# Altium project Siwa_Project.PrjPcb
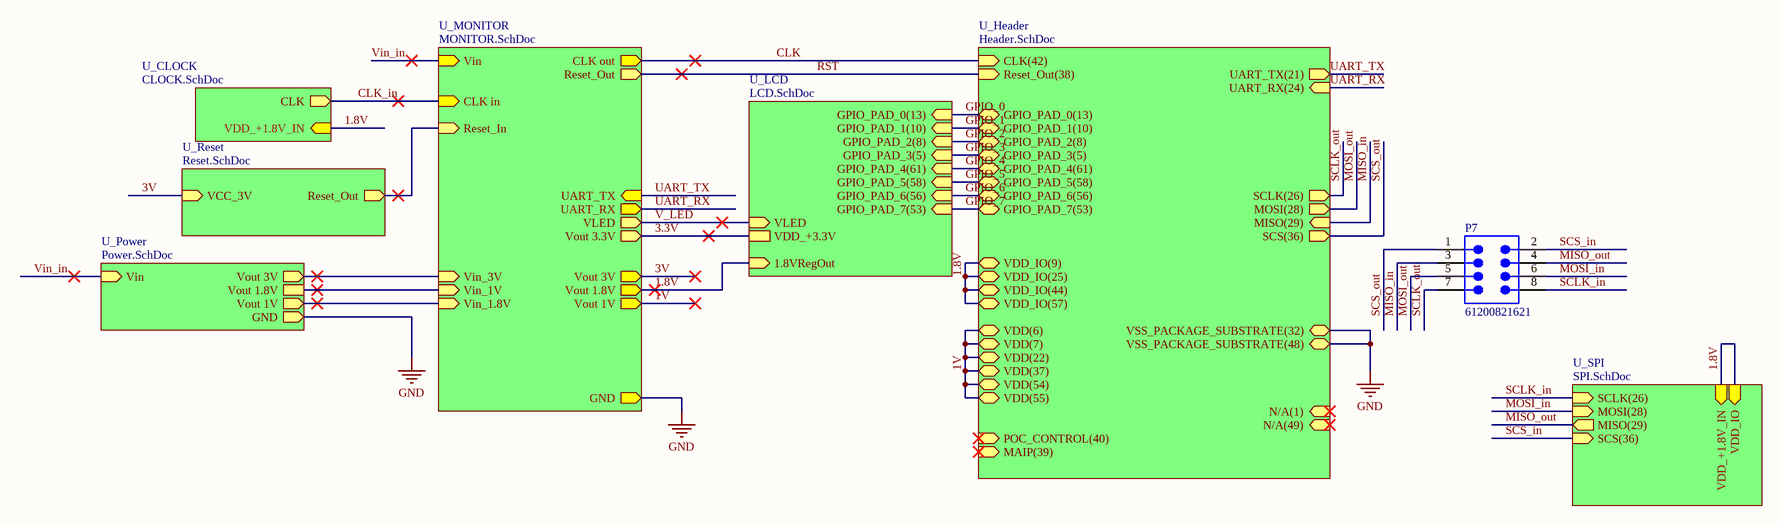
[diagram p0: TOP_SCHEMATIC (1).SchDoc]
9 sheets, 135 parts. Net scope: hierarchical (ports join the sheet entries above them; power ports are global).
Board files: SIWA_PCB.PcbDoc, PCB1.PcbDoc, PCB2.PcbDoc, PCB3.PcbDoc
Sheets:
  TOP_SCHEMATIC (1).SchDoc
    U_Header = Header.SchDoc
    U_CLOCK = CLOCK.SchDoc
    U_SPI = SPI.SchDoc
    U_MONITOR = MONITOR.SchDoc
    U_Power = Power.SchDoc
    U_Reset = Reset.SchDoc
    U_LCD = LCD.SchDoc
  TOP_SCHEMATIC.SchDoc
    U_Header = Header.SchDoc
    U_CLOCK = CLOCK.SchDoc
    U_SPI = SPI.SchDoc
    U_MONITOR = MONITOR.SchDoc
    U_Power = Power.SchDoc
    U_Reset = Reset.SchDoc
    U_LCD = LCD.SchDoc

## Sheet TOP_SCHEMATIC (1).SchDoc
size A3; SheetNumber: 1; SheetTotal: 8

### Parts
P7  61200821621  [61200821621]

### Sub-sheets
U_CLOCK = CLOCK.SchDoc: VDD_+1.8V_IN (in), CLK (out)
U_Header = Header.SchDoc: UART_TX(21) (out), UART_RX(24) (in), VDD(6) (bidir), CLK(42) (in), VDD_IO(44) (bidir), VDD_IO(25) (bidir), VDD_IO(9) (bidir), VDD(7) (bidir), VDD(22) (bidir), Reset_Out(38) (in), VDD(55) (bidir), VDD(54) (bidir), VDD(37) (bidir), SCLK(26) (out), MOSI(28) (out), MISO(29) (in), SCS(36) (out), VSS_PACKAGE_SUBSTRATE(32) (bidir), VSS_PACKAGE_SUBSTRATE(48) (bidir), N/A(1) (in), N/A(49) (in), POC_CONTROL(40) (in), MAIP(39) (in), GPIO_PAD_0(13) (bidir), GPIO_PAD_1(10) (bidir), GPIO_PAD_2(8) (bidir), GPIO_PAD_3(5) (bidir), GPIO_PAD_4(61) (bidir), GPIO_PAD_5(58) (bidir), GPIO_PAD_6(56) (bidir), GPIO_PAD_7(53) (bidir), VDD_IO(57) (bidir)
U_LCD = LCD.SchDoc: GPIO_PAD_0(13) (in), GPIO_PAD_7(53) (in), GPIO_PAD_6(56) (in), GPIO_PAD_5(58) (in), GPIO_PAD_4(61) (in), GPIO_PAD_1(10) (in), GPIO_PAD_2(8) (in), GPIO_PAD_3(5) (in), 1.8VRegOut (in), VDD_+3.3V, VLED (in)
U_MONITOR = MONITOR.SchDoc: Vin (in), CLK in (in), Reset_In (in), GND (out), CLK out (out), Reset_Out (out), UART_TX (in), UART_RX (out), Vout 3V (out), Vout 1.8V (out), Vout 1V (out), Vin_3V (in), Vin_1V (in), Vin_1.8V (in), Vout 3.3V (out), VLED (out)
U_Power = Power.SchDoc: Vin (in), Vout 3V (out), Vout 1.8V, GND (out), Vout 1V (out)
U_Reset = Reset.SchDoc: VCC_3V (in), Reset_Out (out)
U_SPI = SPI.SchDoc: MOSI(28) (in), SCLK(26) (in), MISO(29) (out), SCS(36) (in), VDD_IO (in), VDD_+1.8V_IN (in)

### Nets
GND: sheet U_Header/VSS_PACKAGE_SUBSTRATE(32), sheet U_Header/VSS_PACKAGE_SUBSTRATE(48), sheet U_MONITOR/GND, sheet U_Power/GND
1.8V: sheet U_Header/VDD_IO(44), sheet U_Header/VDD_IO(25), sheet U_Header/VDD_IO(9), sheet U_Header/VDD_IO(57), sheet U_CLOCK/VDD_+1.8V_IN, sheet U_SPI/VDD_IO, sheet U_SPI/VDD_+1.8V_IN, sheet U_MONITOR/Vout 1.8V, sheet U_LCD/1.8VRegOut
1V: sheet U_Header/VDD(6), sheet U_Header/VDD(7), sheet U_Header/VDD(22), sheet U_Header/VDD(55), sheet U_Header/VDD(54), sheet U_Header/VDD(37), sheet U_MONITOR/Vout 1V
3.3V: sheet U_MONITOR/Vout 3.3V, sheet U_LCD/VDD_+3.3V
3V: sheet U_MONITOR/Vout 3V, sheet U_Reset/VCC_3V
CLK: sheet U_Header/CLK(42), sheet U_MONITOR/CLK out
CLK_in: sheet U_CLOCK/CLK, sheet U_MONITOR/CLK in
GPIO_0: sheet U_Header/GPIO_PAD_0(13), sheet U_LCD/GPIO_PAD_0(13)
GPIO_1: sheet U_Header/GPIO_PAD_1(10), sheet U_LCD/GPIO_PAD_1(10)
GPIO_2: sheet U_Header/GPIO_PAD_2(8), sheet U_LCD/GPIO_PAD_2(8)
GPIO_3: sheet U_Header/GPIO_PAD_3(5), sheet U_LCD/GPIO_PAD_3(5)
GPIO_4: sheet U_Header/GPIO_PAD_4(61), sheet U_LCD/GPIO_PAD_4(61)
GPIO_5: sheet U_Header/GPIO_PAD_5(58), sheet U_LCD/GPIO_PAD_5(58)
GPIO_6: sheet U_Header/GPIO_PAD_6(56), sheet U_LCD/GPIO_PAD_6(56)
GPIO_7: sheet U_Header/GPIO_PAD_7(53), sheet U_LCD/GPIO_PAD_7(53)
MISO_in: P7.3 ; sheet U_Header/MISO(29)
MISO_out: P7.4 ; sheet U_SPI/MISO(29)
MOSI_in: P7.6 ; sheet U_SPI/MOSI(28)
MOSI_out: P7.5 ; sheet U_Header/MOSI(28)
RST: sheet U_Header/Reset_Out(38), sheet U_MONITOR/Reset_Out
RST_IN: sheet U_MONITOR/Reset_In, sheet U_Reset/Reset_Out
SCLK_in: P7.8 ; sheet U_SPI/SCLK(26)
SCLK_out: P7.7 ; sheet U_Header/SCLK(26)
SCS_in: P7.2 ; sheet U_SPI/SCS(36)
SCS_out: P7.1 ; sheet U_Header/SCS(36)
UART_RX: sheet U_Header/UART_RX(24), sheet U_MONITOR/UART_RX
UART_TX: sheet U_Header/UART_TX(21), sheet U_MONITOR/UART_TX
V_LED: sheet U_MONITOR/VLED, sheet U_LCD/VLED
Vin_in: sheet U_MONITOR/Vin, sheet U_Power/Vin
Vout 1.8V: sheet U_MONITOR/Vin_1V, sheet U_Power/Vout 1.8V
Vout_1V: sheet U_MONITOR/Vin_1.8V, sheet U_Power/Vout 1V
Vout_3V: sheet U_MONITOR/Vin_3V, sheet U_Power/Vout 3V

### Library data of the parts
P7 = CMP-1502-00006-3: Wr-bhd; 2.54MM Pitch 8 Way 2 Row Shrouded Straight Pcb Header, Surface Mount; Number of Contacts: 8; Operating Supply Voltage: 250V; Gender: Male; Current Rating: 3A; Contact Resistance: 20mΩ; Connector Type: Male Pin; Insulation Resistance: 1GΩ; Pitch: 2.54mm; RoHS: Compliant; Row Spacing: 2.54mm; Color: Black; Termination: Solder; Min Operating Temperature: -40°C; Number of Rows: 2; Number of Positions: 8; Contact Material: Copper; Orientation: Vertical; Number of Pins: 8; Contact Plating: Gold; Insulation Material: PBT; Lead Pitch: 2.54mm; Length: 17.82mm; Max Operating Temperature: 105°C; Mount: Through Hole

## Sheet Header.SchDoc
size A4; SheetNumber: 4; SheetTotal: 8
Used 2 times, as channels U_Header, U_Header. Parts and nets are listed once, with the designators drawn on the sheet.
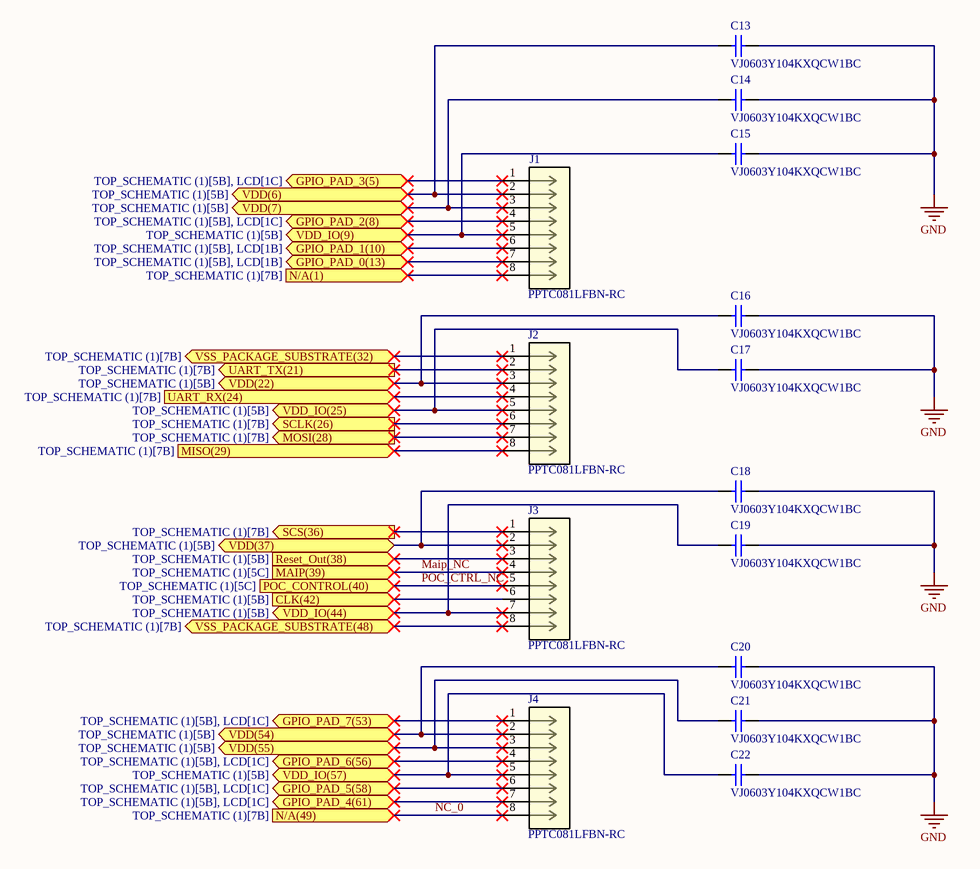
[diagram p1: Header.SchDoc]

### Parts
C13  VJ0603Y104KXQCW1BC  [CAPC1608X95X40NL15T15]
C14  VJ0603Y104KXQCW1BC  [CAPC1608X95X40NL15T15]
C15  VJ0603Y104KXQCW1BC  [CAPC1608X95X40NL15T15]
C16  VJ0603Y104KXQCW1BC  [CAPC1608X95X40NL15T15]
C17  VJ0603Y104KXQCW1BC  [CAPC1608X95X40NL15T15]
C18  VJ0603Y104KXQCW1BC  [CAPC1608X95X40NL15T15]
C19  VJ0603Y104KXQCW1BC  [CAPC1608X95X40NL15T15]
C20  VJ0603Y104KXQCW1BC  [CAPC1608X95X40NL15T15]
C21  VJ0603Y104KXQCW1BC  [CAPC1608X95X40NL15T15]
C22  VJ0603Y104KXQCW1BC  [CAPC1608X95X40NL15T15]
J1  PPTC081LFBN-RC  [CONN_PPTC081LFBN-RC_SUL]
J2  PPTC081LFBN-RC  [CONN_PPTC081LFBN-RC_SUL]
J3  PPTC081LFBN-RC  [CONN_PPTC081LFBN-RC_SUL]
J4  PPTC081LFBN-RC  [CONN_PPTC081LFBN-RC_SUL]

### Ports
CLK(42) (in, see TOP_SCHEMATIC (1)[5B]), GPIO_PAD_0(13) (bidir, see TOP_SCHEMATIC (1)[5B], LCD[1B]), GPIO_PAD_1(10) (bidir, see TOP_SCHEMATIC (1)[5B], LCD[1B]), GPIO_PAD_2(8) (bidir, see TOP_SCHEMATIC (1)[5B], LCD[1C]), GPIO_PAD_3(5) (bidir, see TOP_SCHEMATIC (1)[5B], LCD[1C]), GPIO_PAD_4(61) (bidir, see TOP_SCHEMATIC (1)[5B], LCD[1C]), GPIO_PAD_5(58) (bidir, see TOP_SCHEMATIC (1)[5B], LCD[1C]), GPIO_PAD_6(56) (bidir, see TOP_SCHEMATIC (1)[5B], LCD[1C]), GPIO_PAD_7(53) (bidir, see TOP_SCHEMATIC (1)[5B], LCD[1C]), MAIP(39) (in, see TOP_SCHEMATIC (1)[5C]), MISO(29) (in, see TOP_SCHEMATIC (1)[7B]), MOSI(28) (out, see TOP_SCHEMATIC (1)[7B]), N/A(1) (in, see TOP_SCHEMATIC (1)[7B]), N/A(49) (in, see TOP_SCHEMATIC (1)[7B]), POC_CONTROL(40) (in, see TOP_SCHEMATIC (1)[5C]), Reset_Out(38) (in, see TOP_SCHEMATIC (1)[5B]), SCLK(26) (out, see TOP_SCHEMATIC (1)[7B]), SCS(36) (out, see TOP_SCHEMATIC (1)[7B]), UART_RX(24) (in, see TOP_SCHEMATIC (1)[7B]), UART_TX(21) (out, see TOP_SCHEMATIC (1)[7B]), VDD(6) (bidir, see TOP_SCHEMATIC (1)[5B]), VDD(7) (bidir, see TOP_SCHEMATIC (1)[5B]), VDD(22) (bidir, see TOP_SCHEMATIC (1)[5B]), VDD(37) (bidir, see TOP_SCHEMATIC (1)[5B]), VDD(54) (bidir, see TOP_SCHEMATIC (1)[5B]), VDD(55) (bidir, see TOP_SCHEMATIC (1)[5B]), VDD_IO(9) (bidir, see TOP_SCHEMATIC (1)[5B]), VDD_IO(25) (bidir, see TOP_SCHEMATIC (1)[5B]), VDD_IO(44) (bidir, see TOP_SCHEMATIC (1)[5B]), VDD_IO(57) (bidir, see TOP_SCHEMATIC (1)[5B]), VSS_PACKAGE_SUBSTRATE(32) (bidir, see TOP_SCHEMATIC (1)[7B]), VSS_PACKAGE_SUBSTRATE(48) (bidir, see TOP_SCHEMATIC (1)[7B])

### Nets
GND: C13.2 C14.2 C15.2 C16.2 C17.2 C18.2 C19.2 C20.2 C21.2 C22.2
CLK(42): J3.6 ; port CLK(42)
GPIO_PAD_0(13): J1.7 ; port GPIO_PAD_0(13)
GPIO_PAD_1(10): J1.6 ; port GPIO_PAD_1(10)
GPIO_PAD_2(8): J1.4 ; port GPIO_PAD_2(8)
GPIO_PAD_3(5): J1.1 ; port GPIO_PAD_3(5)
GPIO_PAD_4(61): J4.7 ; port GPIO_PAD_4(61)
GPIO_PAD_5(58): J4.6 ; port GPIO_PAD_5(58)
GPIO_PAD_6(56): J4.4 ; port GPIO_PAD_6(56)
GPIO_PAD_7(53): J4.1 ; port GPIO_PAD_7(53)
Maip_NC: J3.4 ; port MAIP(39)
MISO(29): J2.8 ; port MISO(29)
MOSI(28): J2.7 ; port MOSI(28)
N/A(1): J1.8 ; port N/A(1)
NC_0: J4.8 ; port N/A(49)
POC_CTRL_NC: J3.5 ; port POC_CONTROL(40)
Reset_Out(38): J3.3 ; port Reset_Out(38)
SCLK(26): J2.6 ; port SCLK(26)
SCS(36): J3.1 ; port SCS(36)
UART_RX(24): J2.4 ; port UART_RX(24)
UART_TX(21): J2.2 ; port UART_TX(21)
VDD(6): C13.1 J1.2 ; port VDD(6)
VDD(7): C14.1 J1.3 ; port VDD(7)
VDD(22): C16.1 J2.3 ; port VDD(22)
VDD(37): C18.1 J3.2 ; port VDD(37)
VDD(54): C20.1 J4.2 ; port VDD(54)
VDD(55): C21.1 J4.3 ; port VDD(55)
VDD_IO(9): C15.1 J1.5 ; port VDD_IO(9)
VDD_IO(25): C17.1 J2.5 ; port VDD_IO(25)
VDD_IO(44): C19.1 J3.7 ; port VDD_IO(44)
VDD_IO(57): C22.1 J4.5 ; port VDD_IO(57)
VSS_PACKAGE_SUBSTRATE(32): J2.1 ; port VSS_PACKAGE_SUBSTRATE(32)
VSS_PACKAGE_SUBSTRATE(48): J3.8 ; port VSS_PACKAGE_SUBSTRATE(48)

### Channels
U_Header: ports CLK(42)=CLK GPIO_PAD_0(13)=GPIO_0 GPIO_PAD_1(10)=GPIO_1 GPIO_PAD_2(8)=GPIO_2 GPIO_PAD_3(5)=GPIO_3 GPIO_PAD_4(61)=GPIO_4 GPIO_PAD_5(58)=GPIO_5 GPIO_PAD_6(56)=GPIO_6 GPIO_PAD_7(53)=GPIO_7 MAIP(39)=Maip_NC_U_Header MISO(29)=MISO_in MOSI(28)=MOSI_out N/A(1)=NetJ1_8 N/A(49)=NC_0_U_Header POC_CONTROL(40)=POC_CTRL_NC_U_Header Reset_Out(38)=RST SCLK(26)=SCLK_out SCS(36)=SCS_out UART_RX(24)=UART_RX UART_TX(21)=UART_TX VDD(6)=1V VDD(7)=1V VDD(22)=1V VDD(37)=1V VDD(54)=1V VDD(55)=1V VDD_IO(9)=1.8V VDD_IO(25)=1.8V VDD_IO(44)=1.8V VDD_IO(57)=1.8V VSS_PACKAGE_SUBSTRATE(32)=GND VSS_PACKAGE_SUBSTRATE(48)=GND
U_Header: designators end in _U_Header; ports CLK(42)=NetJ3_U_Header_6 GPIO_PAD_0(13)=NetJ1_U_Header_7 GPIO_PAD_1(10)=NetJ1_U_Header_6 GPIO_PAD_2(8)=NetJ1_U_Header_4 GPIO_PAD_3(5)=NetJ1_U_Header_1 GPIO_PAD_4(61)=NetJ4_U_Header_7 GPIO_PAD_5(58)=NetJ4_U_Header_6 GPIO_PAD_6(56)=NetJ4_U_Header_4 GPIO_PAD_7(53)=NetJ4_U_Header_1 MAIP(39)=Maip_NC_U_Header MISO(29)=MISO MOSI(28)=MOSI N/A(1)=NetJ1_U_Header_8 N/A(49)=NC_0_U_Header POC_CONTROL(40)=POC_CTRL_NC_U_Header Reset_Out(38)=NetJ3_U_Header_3 SCLK(26)=SCLK SCS(36)=SCS UART_RX(24)=UART_RX UART_TX(21)=UART_TX VDD(6)=1.8V VDD(7)=1.8V VDD(22)=1.8V VDD(37)=1.8V VDD(54)=1.8V VDD(55)=1.8V VDD_IO(9)=1.8V VDD_IO(25)=1.8V VDD_IO(44)=1.8V VDD_IO(57)=1.8V VSS_PACKAGE_SUBSTRATE(32)=GND VSS_PACKAGE_SUBSTRATE(48)=GND

### Library data of the parts
C13-C22 = CMP-2006-01550-1: Manufacturer: Vitramon; Part Number: VJ0603Y104KXQCW1BC
J1-J4 = PPTC081LFBN-RC: Description; Manufacturer_Name: Sullins; Copyright: Copyright (C) 2026 Ultra Librarian. All rights reserved.; Manufacturer_Part_Number: PPTC081LFBN-RC; RefDes: RefDes; Type: Type

## Sheet CLOCK.SchDoc
size A4; SheetNumber: 2; SheetTotal: 8
Used 2 times, as channels U_CLOCK, U_CLOCK. Parts and nets are listed once, with the designators drawn on the sheet.
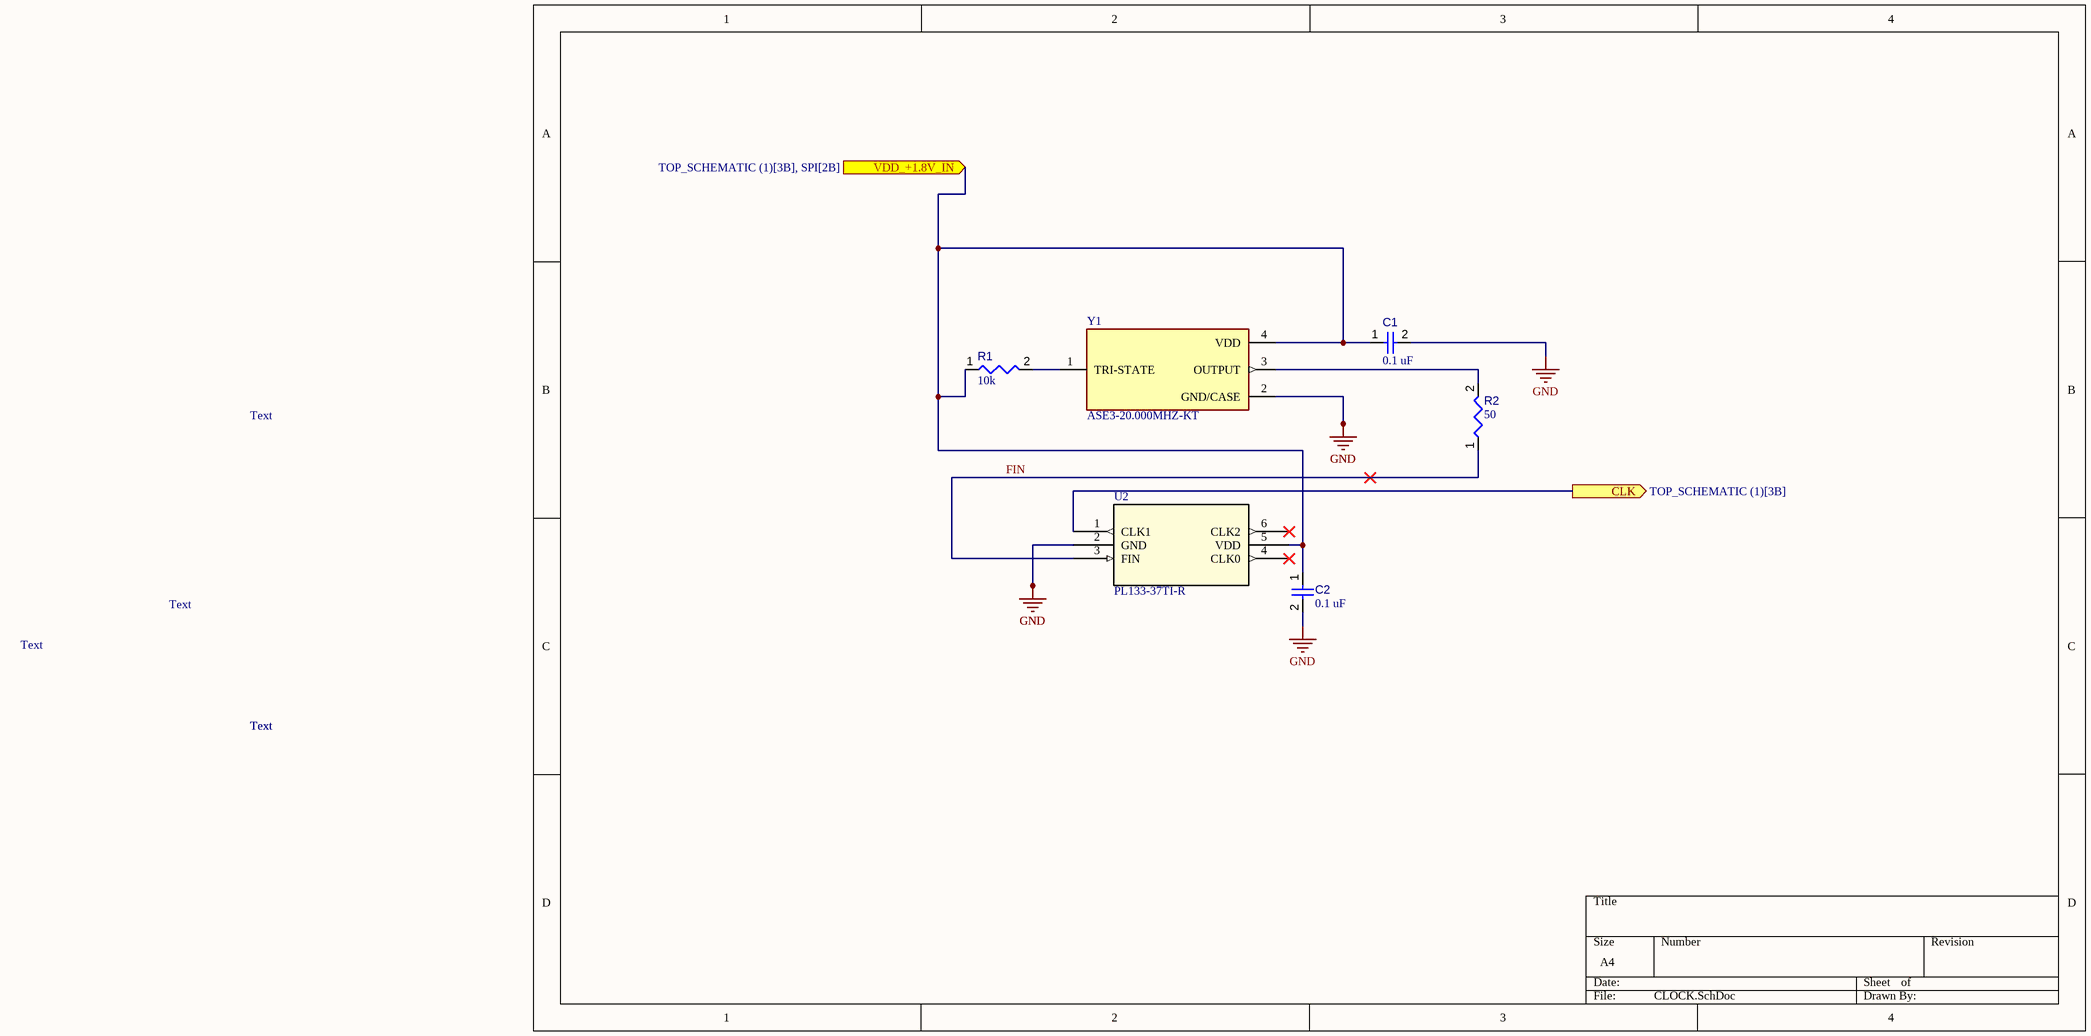
[diagram p2: CLOCK.SchDoc]

### Parts
C1  value 0.1 uF  [CAPC1608X90X40ML10T20]  (hidden comment: Capacitor 0.1 uF)
C2  value 0.1 uF  [CAPC1608X90X40ML10T20]  (hidden comment: Capacitor 0.1 uF)
R1  value 10k  [RESC2013X50X35ML15T15]  (hidden comment: Resistor 10k +/-1% 0805 125 mW)
R2  value 50  [RESC1608X55X25ML10T15]  (hidden comment: Resistor 50 +/-1% 0603 100 mW)
U2  PL133-37TI-R  [SOT-23-6_MC_MCH]
Y1  ASE3-20.000MHZ-KT  [XTAL_ASE3-20.000MHZ-KT]

### Ports
CLK (out, see TOP_SCHEMATIC (1)[3B]), VDD_+1.8V_IN (in, see TOP_SCHEMATIC (1)[3B], SPI[2B])

### Nets
GND: C1.2 C2.2 U2.2(GND) Y1.2(GND/CASE)
CLK: U2.1(CLK1) ; port CLK
FIN: R2.1 U2.3(FIN)
VDD_+1.8V_IN: C1.1 C2.1 R1.1 U2.5(VDD) Y1.4(VDD) ; port VDD_+1.8V_IN
NetR1_2: R1.2 Y1.1(TRI-STATE)
NetR2_2: R2.2 Y1.3(OUTPUT)

Not connected (* = marked no-connect by the designer): U2 4(CLK0)* 6(CLK2)*

### Channels
U_CLOCK: ports CLK=CLK_in VDD_+1.8V_IN=1.8V
U_CLOCK: designators end in _U_CLOCK; ports CLK=NetP6_U_MONITOR_7 VDD_+1.8V_IN=1.8V

### Notes on the sheet
- Text

### Library data of the parts
C1 C2 = CMP-001-00014-6: Chip Capacitor, 0.1 uF 0603; Capacitor Type: Ceramic; Tolerance: 5%; Voltage Rating: 50V; RoHS Compliant: True; Case/Package: 0603; Max Operating Temperature: 125°C; Pins: 2; Mounting Technology: SM; Min Operating Temperature: -55°C
R1 = CMP-009-00018-5: Chip Resistor, 10 KOhm, +/- 1%, 125 mW, -55 to 155 degC, 0805 (2012 Metric); Power: 125mW; Voltage Rating: 150V; Tolerance: 1%; Pins: 2; Min Operating Temperature: -55°C; Case/Package: 0805; Max Operating Temperature: 155°C; RoHS Compliant: True; Mounting Technology: SM
R2 = CMP-009-00017-5: Chip Resistor, 50 Ohm 0603; Voltage Rating: 50V; Power: 100mW; Tolerance: 1%; RoHS Compliant: True; Min Operating Temperature: -55°C; Pins: 2; Case/Package: 0603; Mounting Technology: SM; Max Operating Temperature: 155°C
U2 = PL133-37TI-R: Description; Manufacturer_Name: Microchip; Copyright: Copyright (C) 2025 Ultra Librarian. All rights reserved.; Manufacturer_Part_Number: PL133-37TI-R; RefDes: RefDes; Type: Type
Y1 = ASE3-20.000MHZ-KT: Price: None; MP: ASE3-20.000MHZ-KT; Availability: Unavailable; Value: *; Package: None

## Sheet SPI.SchDoc
size A4; SheetNumber: 3; SheetTotal: 8
Used 2 times, as channels U_SPI, U_SPI. Parts and nets are listed once, with the designators drawn on the sheet.
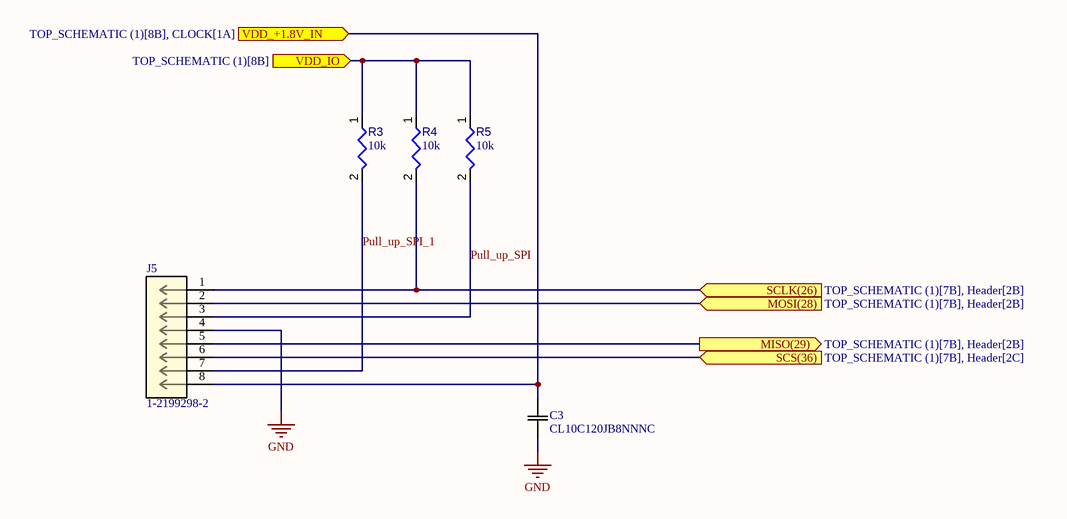
[diagram p3: SPI.SchDoc]

### Parts
C3  CL10C120JB8NNNC  [CAP_CL10_SAM]
J5  1-2199298-2  [CONN8_1-2199298-2_TEC]
R3  value 10k  [RESC2013X50X35ML15T15]  (hidden comment: Resistor 10k +/-1% 0805 125 mW)
R4  value 10k  [RESC2013X50X35ML15T15]  (hidden comment: Resistor 10k +/-1% 0805 125 mW)
R5  value 10k  [RESC2013X50X35ML15T15]  (hidden comment: Resistor 10k +/-1% 0805 125 mW)

### Ports
MISO(29) (out, see TOP_SCHEMATIC (1)[7B], Header[2B]), MOSI(28) (in, see TOP_SCHEMATIC (1)[7B], Header[2B]), SCLK(26) (in, see TOP_SCHEMATIC (1)[7B], Header[2B]), SCS(36) (in, see TOP_SCHEMATIC (1)[7B], Header[2C]), VDD_+1.8V_IN (in, see TOP_SCHEMATIC (1)[8B], CLOCK[1A]), VDD_IO (in, see TOP_SCHEMATIC (1)[8B])

### Nets
GND: C3.1 J5.4
MISO(29): J5.5 ; port MISO(29)
MOSI(28): J5.2 ; port MOSI(28)
Pull_up_SPI: J5.3 R5.2
Pull_up_SPI_1: J5.7 R3.2
SCLK(26): J5.1 R4.2 ; port SCLK(26)
SCS(36): J5.6 ; port SCS(36)
VDD_+1.8V_IN: C3.2 J5.8 ; port VDD_+1.8V_IN
VDD_IO: R3.1 R4.1 R5.1 ; port VDD_IO

### Channels
U_SPI: ports MISO(29)=MISO_out MOSI(28)=MOSI_in SCLK(26)=SCLK_in SCS(36)=SCS_in VDD_+1.8V_IN=1.8V VDD_IO=1.8V
U_SPI: designators end in _U_SPI; ports MISO(29)=MISO MOSI(28)=MOSI SCLK(26)=SCLK SCS(36)=SCS VDD_+1.8V_IN=1.8V VDD_IO=1.8V

### Library data of the parts
C3 = CL10C120JB8NNNC: No Description Available; Manufacturer_Name: Samsung; Copyright: Copyright (C) 2026 Ultra Librarian. All rights reserved.; Manufacturer_Part_Number: CL10C120JB8NNNC
J5 = 1-2199298-2: 8P,DIP SKT,300 CL,LDR,PB FREE; Manufacturer_Name: TE Connectivity; TYPE: DIP; Copyright: Copyright (C) 2026 Ultra Librarian. All rights reserved.; Manufacturer_Part_Number: 1-2199298-2; RefDes: RefDes
R3-R5 = CMP-009-00018-5: as R1 on sheet CLOCK; Tolerance: 1%; Pins: 2; Min Operating Temperature: -55°C; Case/Package: 0805; Max Operating Temperature: 155°C; RoHS Compliant: True; Mounting Technology: SM

## Sheet MONITOR.SchDoc
size A4; SheetNumber: 8; SheetTotal: 8
Used 2 times, as channels U_MONITOR, U_MONITOR. Parts and nets are listed once, with the designators drawn on the sheet.
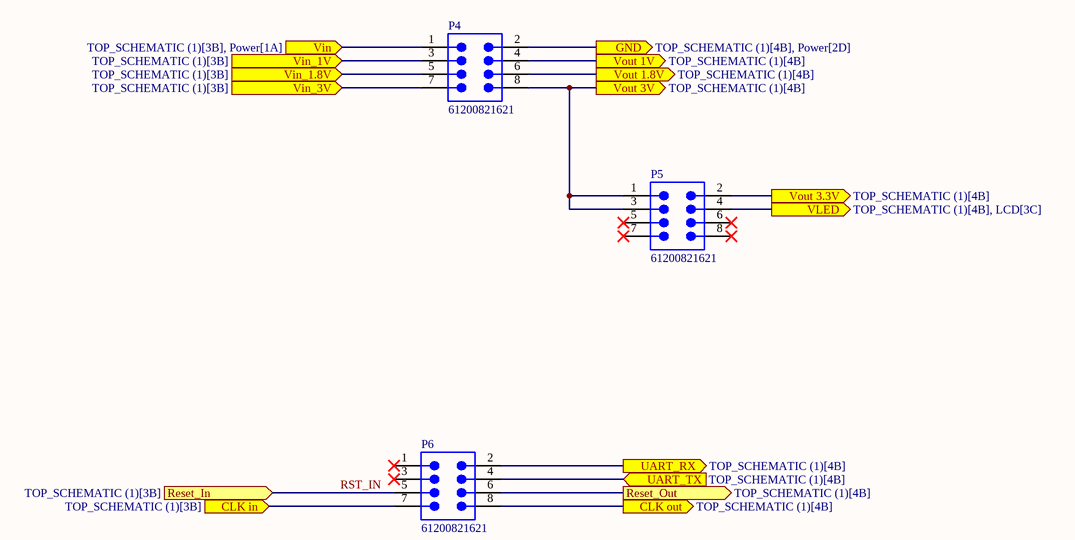
[diagram p4: MONITOR.SchDoc]

### Parts
P4  61200821621  [61200821621]
P5  61200821621  [61200821621]
P6  61200821621  [61200821621]

### Ports
CLK in (in, see TOP_SCHEMATIC (1)[3B]), CLK out (out, see TOP_SCHEMATIC (1)[4B]), GND (out, see TOP_SCHEMATIC (1)[4B], Power[2D]), Reset_In (in, see TOP_SCHEMATIC (1)[3B]), Reset_Out (out, see TOP_SCHEMATIC (1)[4B]), UART_RX (out, see TOP_SCHEMATIC (1)[4B]), UART_TX (in, see TOP_SCHEMATIC (1)[4B]), Vin (in, see TOP_SCHEMATIC (1)[3B], Power[1A]), Vin_1.8V (in, see TOP_SCHEMATIC (1)[3B]), Vin_1V (in, see TOP_SCHEMATIC (1)[3B]), Vin_3V (in, see TOP_SCHEMATIC (1)[3B]), VLED (out, see TOP_SCHEMATIC (1)[4B], LCD[3C]), Vout 1.8V (out, see TOP_SCHEMATIC (1)[4B]), Vout 1V (out, see TOP_SCHEMATIC (1)[4B]), Vout 3.3V (out, see TOP_SCHEMATIC (1)[4B]), Vout 3V (out, see TOP_SCHEMATIC (1)[4B])

### Nets
CLK in: P6.7 ; port CLK in
CLK out: P6.8 ; port CLK out
GND: P4.2 ; port GND
Reset_Out: P6.6 ; port Reset_Out
RST_IN: P6.5 ; port Reset_In
UART_RX: P6.2 ; port UART_RX
UART_TX: P6.4 ; port UART_TX
Vin: P4.1 ; port Vin
Vin_1.8V: P4.5 ; port Vin_1.8V
Vin_1V: P4.3 ; port Vin_1V
Vin_3V: P4.7 ; port Vin_3V
VLED: P5.4 ; port VLED
Vout 1.8V: P4.6 ; port Vout 1.8V
Vout 1V: P4.4 ; port Vout 1V
Vout 3.3V: P5.2 ; port Vout 3.3V
Vout 3V: P4.8 P5.1 P5.3 ; port Vout 3V

Not connected (* = marked no-connect by the designer): P5 5* 6* 7* 8*; P6 1* 3*

### Channels
U_MONITOR: ports CLK in=CLK_in CLK out=CLK GND=GND Reset_In=RST_IN Reset_Out=RST UART_RX=UART_RX UART_TX=UART_TX Vin=Vin_in Vin_1.8V=Vout_1V Vin_1V=Vout 1.8V Vin_3V=Vout_3V VLED=V_LED Vout 1.8V=1.8V Vout 1V=1V Vout 3.3V=3.3V Vout 3V=3V
U_MONITOR: designators end in _U_MONITOR; ports CLK in=NetP6_U_MONITOR_7 CLK out=NetJ3_U_Header_6 GND=GND Reset_In=RST_IN Reset_Out=NetJ3_U_Header_3 UART_RX=UART_RX UART_TX=UART_TX Vin=Vin_in Vin_1.8V=Vout_1V Vin_1V=Vout 1.8V Vin_3V=Vout_3V VLED=VCC Vout 1.8V=1.8V Vout 1V=1V Vout 3.3V=VDD_+3.3V Vout 3V=3V

### Library data of the parts
P4-P6 = CMP-1502-00006-3: as P7 on sheet TOP_SCHEMATIC (1); Pitch: 2.54mm; RoHS: Compliant; Row Spacing: 2.54mm; Color: Black; Termination: Solder; Min Operating Temperature: -40°C; Number of Rows: 2; Number of Positions: 8; Contact Material: Copper; Orientation: Vertical; Number of Pins: 8; Contact Plating: Gold; Insulation Material: PBT; Lead Pitch: 2.54mm; Length: 17.82mm; Max Operating Temperature: 105°C; Mount: Through Hole

## Sheet Power.SchDoc
size A4; SheetNumber: 5; SheetTotal: 8
Used 2 times, as channels U_Power, U_Power. Parts and nets are listed once, with the designators drawn on the sheet.
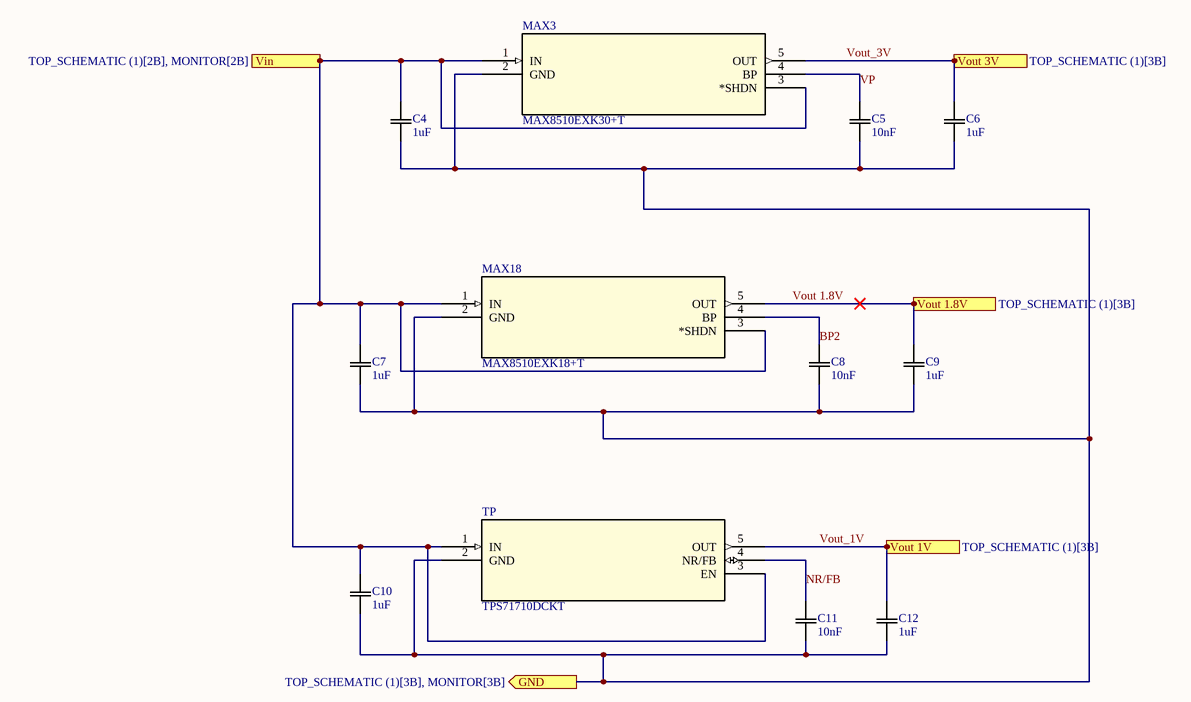
[diagram p5: Power.SchDoc]

### Parts
C4  1uF  [CAP_CL10_SAM]
C5  10nF  [CAP_CL10_SAM]
C6  1uF  [CAP_CL10_SAM]
C7  1uF  [CAP_CL10_SAM]
C8  10nF  [CAP_CL10_SAM]
C9  1uF  [CAP_CL10_SAM]
C10  1uF  [CAP_CL10_SAM]
C11  10nF  [CAP_CL10_SAM]
C12  1uF  [CAP_CL10_SAM]
MAX3  MAX8510EXK30+T  [21-0076E_MXM]
MAX18  MAX8510EXK18+T  [21-0076E_MXM]
TP  TPS71710DCKT  [DCK5]

### Ports
GND (out, see TOP_SCHEMATIC (1)[3B], MONITOR[3B]), Vin (in, see TOP_SCHEMATIC (1)[2B], MONITOR[2B]), Vout 1.8V (see TOP_SCHEMATIC (1)[3B]), Vout 1V (out, see TOP_SCHEMATIC (1)[3B]), Vout 3V (out, see TOP_SCHEMATIC (1)[3B])

### Nets
BP2: C8.2 MAX18.4(BP)
GND: C4.1 C5.1 C6.1 C7.1 C8.1 C9.1 C10.1 C11.1 C12.1 MAX3.2(GND) MAX18.2(GND) TP.2(GND) ; port GND
NR/FB: C11.2 TP.4(NR/FB)
Vin: C4.2 C7.2 C10.2 MAX3.1(IN) MAX3.3(*SHDN) MAX18.1(IN) MAX18.3(*SHDN) TP.1(IN) TP.3(EN) ; port Vin
Vout 1.8V: C9.2 MAX18.5(OUT) ; port Vout 1.8V
Vout_1V: C12.2 TP.5(OUT) ; port Vout 1V
Vout_3V: C6.2 MAX3.5(OUT) ; port Vout 3V
VP: C5.2 MAX3.4(BP)

### Channels
U_Power: ports GND=GND Vin=Vin_in Vout 1.8V=Vout 1.8V Vout 1V=Vout_1V Vout 3V=Vout_3V
U_Power: designators end in _U_Power; ports GND=GND Vin=Vin_in Vout 1.8V=Vout 1.8V Vout 1V=Vout_1V Vout 3V=Vout_3V

### Library data of the parts
C4-C12 = CL10C120JB8NNNC: as C3 on sheet SPI; Copyright: Copyright (C) 2026 Ultra Librarian. All rights reserved.; Manufacturer_Part_Number: CL10C120JB8NNNC
MAX3 MAX18 = MAX8510EXK30+T: Ultra-Low-Noise, High PSRR, Low-Dropout, 120mA Linear Regulators; Manufacturer_Name: Analog Devices Inc; Copyright: Copyright (C) 2026 Ultra Librarian. All rights reserved.; Manufacturer_Part_Number: MAX8510EXK30+T; RefDes: RefDes; Type: Type
TP = TPS71710DCKT: 150-mA, high-PSRR, low-IQ, low-dropout voltage regulator with enable 5-SC70 -40 to 125; Manufacturer_Name: Texas Instruments; Copyright: Copyright (C) 2026 Ultra Librarian. All rights reserved.; Manufacturer_Part_Number: TPS71710DCKT; Datasheet: https://www.ti.com/lit/gpn/tps717; RefDes: RefDes; Type: Type

## Sheet Reset.SchDoc
size A4; SheetNumber: 6; SheetTotal: 8
Used 2 times, as channels U_Reset, U_Reset. Parts and nets are listed once, with the designators drawn on the sheet.
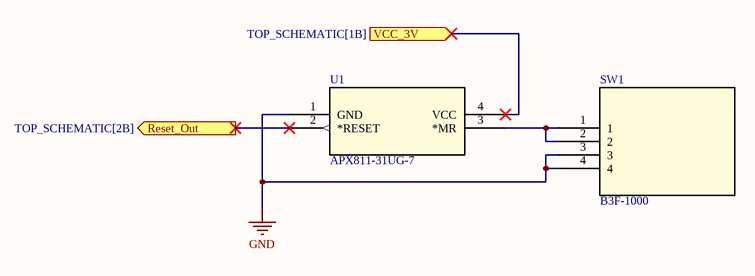
[diagram p6: Reset.SchDoc]

### Parts
SW1  B3F-1000  [SW_B3F-1000_OMR]
U1  APX811-31UG-7  [APX811-31UG-7_DIO]

### Ports
Reset_Out (out, see TOP_SCHEMATIC[2B]), VCC_3V (in, see TOP_SCHEMATIC[1B])

### Nets
GND: SW1.3 SW1.4 U1.1(GND)
Reset_Out: U1.2(*RESET) ; port Reset_Out
VCC_3V: U1.4(VCC) ; port VCC_3V
NetSW1_1: SW1.1 SW1.2 U1.3(*MR)

### Channels
U_Reset: ports Reset_Out=RST_IN VCC_3V=3V
U_Reset: designators end in _U_Reset; ports Reset_Out=RST_IN VCC_3V=3V

### Library data of the parts
SW1 = B3F-1000: Description; Manufacturer_Name: Omron; Copyright: Copyright (C) 2026 Ultra Librarian. All rights reserved.; Manufacturer_Part_Number: B3F-1000; RefDes: RefDes; Type: Type
U1 = APX811-31UG-7: No Description Available; Manufacturer_Name: Diodes Inc; Copyright: Copyright (C) 2026 Ultra Librarian. All rights reserved.; Manufacturer_Part_Number: APX811-31UG-7; RefDes: RefDes; Type: Type

## Sheet LCD.SchDoc
size A; SheetNumber: 7; SheetTotal: 8
Used 2 times, as channels U_LCD, U_LCD. Parts and nets are listed once, with the designators drawn on the sheet.
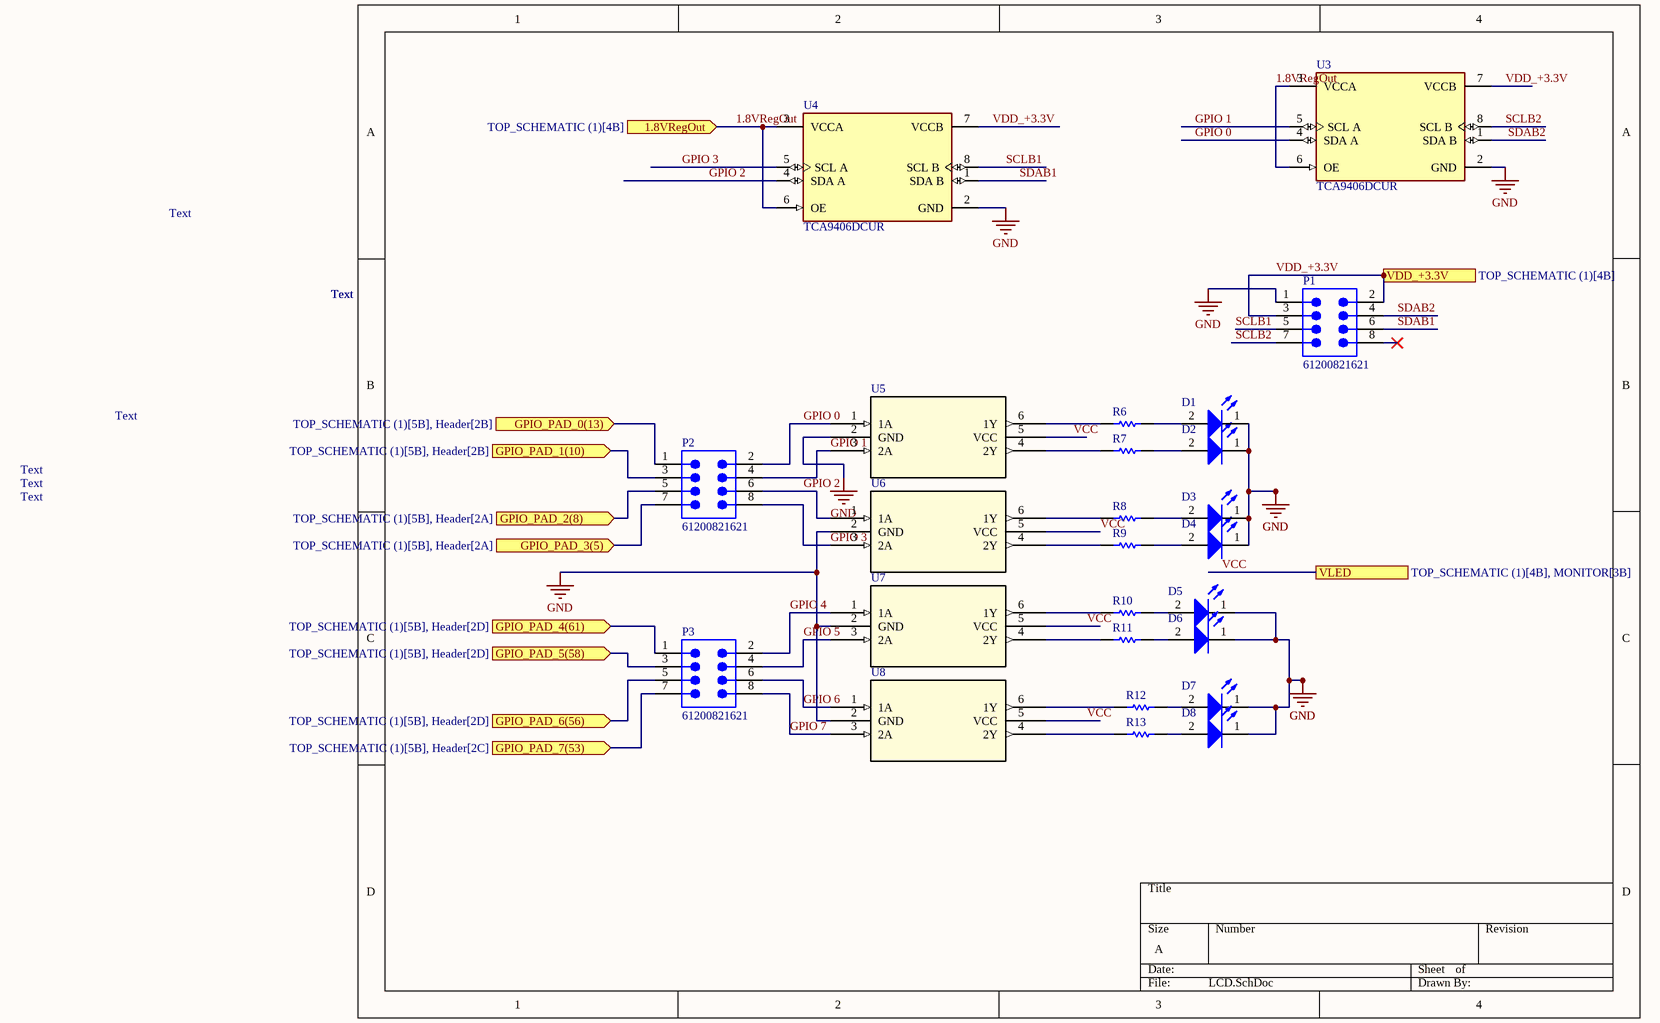
[diagram p7: LCD.SchDoc]

### Parts
D1  150120BS75000  [WL-SMCW_1206_150120xx75000]  (value not drawn)
D2  150120BS75000  [WL-SMCW_1206_150120xx75000]  (value not drawn)
D3  150120BS75000  [WL-SMCW_1206_150120xx75000]  (value not drawn)
D4  150120BS75000  [WL-SMCW_1206_150120xx75000]  (value not drawn)
D5  150120BS75000  [WL-SMCW_1206_150120xx75000]  (value not drawn)
D6  150120BS75000  [WL-SMCW_1206_150120xx75000]  (value not drawn)
D7  150120BS75000  [WL-SMCW_1206_150120xx75000]  (value not drawn)
D8  150120BS75000  [WL-SMCW_1206_150120xx75000]  (value not drawn)
P1  61200821621  [61200821621]
P2  61200821621  [61200821621]
P3  61200821621  [61200821621]
R6  RC1206FR-10750RL  [RESC3116X65X40LL10T20]  (value not drawn)
R7  RC1206FR-10750RL  [RESC3116X65X40LL10T20]  (value not drawn)
R8  RC1206FR-10750RL  [RESC3116X65X40LL10T20]  (value not drawn)
R9  RC1206FR-10750RL  [RESC3116X65X40LL10T20]  (value not drawn)
R10  RC1206FR-10750RL  [RESC3116X65X40LL10T20]  (value not drawn)
R11  RC1206FR-10750RL  [RESC3116X65X40LL10T20]  (value not drawn)
R12  RC1206FR-10750RL  [RESC3116X65X40LL10T20]  (value not drawn)
R13  RC1206FR-10750RL  [RESC3116X65X40LL10T20]  (value not drawn)
U3  TCA9406DCUR  [FP-DCU0008A-IPC_B]
U4  TCA9406DCUR  [FP-DCU0008A-IPC_B]
U5  74LVC2G17GV,125  [SC-74;TSOP6_NEX]  (value not drawn)
U6  74LVC2G17GV,125  [SC-74;TSOP6_NEX]  (value not drawn)
U7  74LVC2G17GV,125  [SC-74;TSOP6_NEX]  (value not drawn)
U8  74LVC2G17GV,125  [SC-74;TSOP6_NEX]  (value not drawn)

### Ports
1.8VRegOut (in, see TOP_SCHEMATIC (1)[4B]), GPIO_PAD_0(13) (in, see TOP_SCHEMATIC (1)[5B], Header[2B]), GPIO_PAD_1(10) (in, see TOP_SCHEMATIC (1)[5B], Header[2B]), GPIO_PAD_2(8) (in, see TOP_SCHEMATIC (1)[5B], Header[2A]), GPIO_PAD_3(5) (in, see TOP_SCHEMATIC (1)[5B], Header[2A]), GPIO_PAD_4(61) (in, see TOP_SCHEMATIC (1)[5B], Header[2D]), GPIO_PAD_5(58) (in, see TOP_SCHEMATIC (1)[5B], Header[2D]), GPIO_PAD_6(56) (in, see TOP_SCHEMATIC (1)[5B], Header[2D]), GPIO_PAD_7(53) (in, see TOP_SCHEMATIC (1)[5B], Header[2C]), VDD_+3.3V (see TOP_SCHEMATIC (1)[4B]), VLED (see TOP_SCHEMATIC (1)[4B], MONITOR[3B])

### Nets
GND: D1.1(K) D2.1(K) D3.1(K) D4.1(K) D5.1(K) D6.1(K) D7.1(K) D8.1(K) P1.1 U3.2(GND) U4.2(GND) U5.2(GND) U6.2(GND) U7.2(GND) U8.2(GND)
1.8VRegOut: U3.3(VCCA) U3.6(OE) U4.3(VCCA) U4.6(OE) ; port 1.8VRegOut
GPIO 0: P2.2 U3.4(SDA_A) U5.1(1A)
GPIO 1: P2.4 U3.5(SCL_A) U5.3(2A)
GPIO 2: P2.6 U4.4(SDA_A) U6.1(1A)
GPIO 3: P2.8 U4.5(SCL_A) U6.3(2A)
GPIO 4: P3.2 U7.1(1A)
GPIO 5: P3.4 U7.3(2A)
GPIO 6: P3.6 U8.1(1A)
GPIO 7: P3.8 U8.3(2A)
GPIO_PAD_0(13): P2.1 ; port GPIO_PAD_0(13)
GPIO_PAD_1(10): P2.3 ; port GPIO_PAD_1(10)
GPIO_PAD_2(8): P2.5 ; port GPIO_PAD_2(8)
GPIO_PAD_3(5): P2.7 ; port GPIO_PAD_3(5)
GPIO_PAD_4(61): P3.1 ; port GPIO_PAD_4(61)
GPIO_PAD_5(58): P3.3 ; port GPIO_PAD_5(58)
GPIO_PAD_6(56): P3.5 ; port GPIO_PAD_6(56)
GPIO_PAD_7(53): P3.7 ; port GPIO_PAD_7(53)
SCLB1: P1.5 U4.8(SCL_B)
SCLB2: P1.7 U3.8(SCL_B)
SDAB1: P1.6 U4.1(SDA_B)
SDAB2: P1.4 U3.1(SDA_B)
VCC: U5.5(VCC) U6.5(VCC) U7.5(VCC) U8.5(VCC) ; port VLED
VDD_+3.3V: P1.2 P1.3 U3.7(VCCB) U4.7(VCCB) ; port VDD_+3.3V
NetD1_2: D1.2(A) R6.2
NetD2_2: D2.2(A) R7.2
NetD3_2: D3.2(A) R8.2
NetD4_2: D4.2(A) R9.2
NetD5_2: D5.2(A) R10.2
NetD6_2: D6.2(A) R11.2
NetD7_2: D7.2(A) R12.2
NetD8_2: D8.2(A) R13.2
NetR6_1: R6.1 U5.6(1Y)
NetR7_1: R7.1 U5.4(2Y)
NetR8_1: R8.1 U6.6(1Y)
NetR9_1: R9.1 U6.4(2Y)
NetR10_1: R10.1 U7.6(1Y)
NetR11_1: R11.1 U7.4(2Y)
NetR12_1: R12.1 U8.6(1Y)
NetR13_1: R13.1 U8.4(2Y)

Not connected (* = marked no-connect by the designer): P1 8*

### Channels
U_LCD: ports 1.8VRegOut=1.8V GPIO_PAD_0(13)=GPIO_0 GPIO_PAD_1(10)=GPIO_1 GPIO_PAD_2(8)=GPIO_2 GPIO_PAD_3(5)=GPIO_3 GPIO_PAD_4(61)=GPIO_4 GPIO_PAD_5(58)=GPIO_5 GPIO_PAD_6(56)=GPIO_6 GPIO_PAD_7(53)=GPIO_7 VDD_+3.3V=3.3V VLED=V_LED
U_LCD: designators end in _U_LCD; ports 1.8VRegOut=1.8V GPIO_PAD_0(13)=NetJ1_U_Header_7 GPIO_PAD_1(10)=NetJ1_U_Header_6 GPIO_PAD_2(8)=NetJ1_U_Header_4 GPIO_PAD_3(5)=NetJ1_U_Header_1 GPIO_PAD_4(61)=NetJ4_U_Header_7 GPIO_PAD_5(58)=NetJ4_U_Header_6 GPIO_PAD_6(56)=NetJ4_U_Header_4 GPIO_PAD_7(53)=NetJ4_U_Header_1 VDD_+3.3V=VDD_+3.3V VLED=VCC

### Notes on the sheet
- Text

### Library data of the parts
D1-D8 = CMP-1426-00015-4: Wurth Elektronik LED, WL-SMCW, 3216 (1206), 470 nm, 3.2 x 1.6 x 0.68mm; Manufacturer Package Identifier: LED_1206; Manufacturer Lifecycle Status: ACTIVE; Test Current: 20mA; Color: Blue; YEOL: 1 = Estimated lifetime > 10 years; Wavelength: 470nm; Viewing Angle: 140°; Peak Wavelength: 465nm; Forward Voltage: 3.2V; Luminous Intensity: 145mcd; Forward Current: 100mA; Lens Style: Clear, Rectangular; Max Reverse Voltage (DC): 5V; Case/Package: 1206; Case Code (Imperial): 1206; RoHS: Compliant; Case Code (Metric): 3216; Height: 680µm; REACH SVHC: Unknown; Length: 3.2mm; Mount: Surface Mount; Packaging: Tape and Reel; Min Operating Temperature: -40°C; Width: 1.6mm; Lifecycle Status: Production; Max Operating Temperature: 85°C; Dominant Wavelength: 470nm
P1-P3 = CMP-1502-00006-3: as P7 on sheet TOP_SCHEMATIC (1); Pitch: 2.54mm; RoHS: Compliant; Row Spacing: 2.54mm; Color: Black; Termination: Solder; Min Operating Temperature: -40°C; Number of Rows: 2; Number of Positions: 8; Contact Material: Copper; Orientation: Vertical; Number of Pins: 8; Contact Plating: Gold; Insulation Material: PBT; Lead Pitch: 2.54mm; Length: 17.82mm; Max Operating Temperature: 105°C; Mount: Through Hole
R6-R13 = CMP-2003-04964-1: Manufacturer: Yageo; Part Number: RC1206FR-10750RL
U3 U4 = CMP-0314-00417-3: IC TRNSLTR BIDIRECTIONAL US8; Propagation Delay: 4.4ns; Min Supply Voltage: 1.65V; Low Level Output Current: 50mA; Logic Function: Translator; Data Rate: 24Mbps; Turn-On Delay Time: 260ns; Max Supply Voltage: 5.5V; Number of Channels: 2; High Level Output Current: -50mA; Output Type: Voltage; Number of Pins: 8; Weight: 0.00067oz; Lead Free: Lead Free; Case/Package: VSSOP; Packaging: Tape and Reel; REACH SVHC: No SVHC; Package Quantity: 1; Length: 2.1mm; Contact Plating: Gold; Width: 2.4mm; Radiation Hardening: No; Number of Bits: 2; Height: 0.8mm; Number of Outputs: 2; Max Operating Temperature: 85°C; Min Operating Temperature: -40°C
U5-U8 = 74LVC2G17GV,125: Description; Manufacturer_Name: Nexperia; Type: Logic; Copyright: Copyright (C) 2026 Ultra Librarian. All rights reserved.; Manufacturer_Part_Number: 74LVC2G17GV,125; RefDes: RefDes

## Sheet TOP_SCHEMATIC.SchDoc
size A3; SheetNumber: 1; SheetTotal: 8
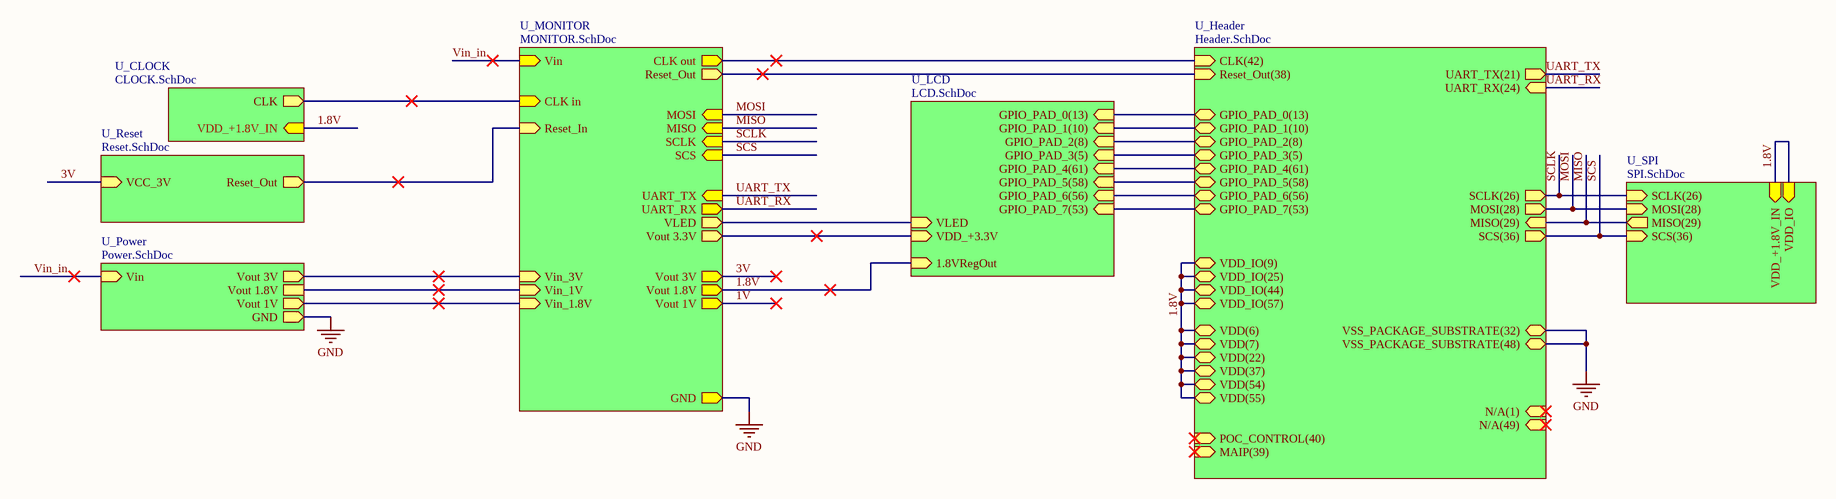
[diagram p8: TOP_SCHEMATIC.SchDoc]

### Sub-sheets
U_CLOCK = CLOCK.SchDoc: VDD_+1.8V_IN (in), CLK (out)
U_Header = Header.SchDoc: UART_TX(21) (out), UART_RX(24) (in), VDD(6) (bidir), CLK(42) (in), VDD_IO(44) (bidir), VDD_IO(25) (bidir), VDD_IO(9) (bidir), VDD(7) (bidir), VDD(22) (bidir), Reset_Out(38) (in), VDD(55) (bidir), VDD(54) (bidir), VDD(37) (bidir), SCLK(26) (out), MOSI(28) (out), MISO(29) (in), SCS(36) (out), VSS_PACKAGE_SUBSTRATE(32) (bidir), VSS_PACKAGE_SUBSTRATE(48) (bidir), N/A(1) (in), N/A(49) (in), POC_CONTROL(40) (in), MAIP(39) (in), GPIO_PAD_0(13) (bidir), GPIO_PAD_1(10) (bidir), GPIO_PAD_2(8) (bidir), GPIO_PAD_3(5) (bidir), GPIO_PAD_4(61) (bidir), GPIO_PAD_5(58) (bidir), GPIO_PAD_6(56) (bidir), GPIO_PAD_7(53) (bidir), VDD_IO(57) (bidir)
U_LCD = LCD.SchDoc: GPIO_PAD_0(13) (in), GPIO_PAD_7(53) (in), GPIO_PAD_6(56) (in), GPIO_PAD_5(58) (in), GPIO_PAD_4(61) (in), GPIO_PAD_1(10) (in), GPIO_PAD_2(8) (in), GPIO_PAD_3(5) (in), 1.8VRegOut (in), VDD_+3.3V, VLED (in)
U_MONITOR = MONITOR.SchDoc: Vin (in), CLK in (in), Reset_In (in), GND (out), CLK out (out), Reset_Out (out), MISO (in), SCLK (in), SCS (in), UART_TX (in), UART_RX (out), Vout 3V (out), Vout 1.8V (out), Vout 1V (out), Vin_3V (in), Vin_1V (in), Vin_1.8V (in), Vout 3.3V (out), MOSI (in), VLED (out)
U_Power = Power.SchDoc: Vin (in), Vout 3V (out), Vout 1.8V, GND (out), Vout 1V (out)
U_Reset = Reset.SchDoc: VCC_3V (in), Reset_Out (out)
U_SPI = SPI.SchDoc: MOSI(28) (in), SCLK(26) (in), MISO(29) (out), SCS(36) (in), VDD_IO (in), VDD_+1.8V_IN (in)

### Nets
GND: sheet U_Header/VSS_PACKAGE_SUBSTRATE(32), sheet U_Header/VSS_PACKAGE_SUBSTRATE(48), sheet U_MONITOR/GND, sheet U_Power/GND
1.8V: sheet U_Header/VDD(6), sheet U_Header/VDD_IO(44), sheet U_Header/VDD_IO(25), sheet U_Header/VDD_IO(9), sheet U_Header/VDD(7), sheet U_Header/VDD(22), sheet U_Header/VDD(55), sheet U_Header/VDD(54), sheet U_Header/VDD(37), sheet U_Header/VDD_IO(57), sheet U_CLOCK/VDD_+1.8V_IN, sheet U_SPI/VDD_IO, sheet U_SPI/VDD_+1.8V_IN, sheet U_MONITOR/Vout 1.8V, sheet U_LCD/1.8VRegOut
3V: sheet U_MONITOR/Vout 3V, sheet U_Reset/VCC_3V
MISO: sheet U_Header/MISO(29), sheet U_SPI/MISO(29), sheet U_MONITOR/MISO
MOSI: sheet U_Header/MOSI(28), sheet U_SPI/MOSI(28), sheet U_MONITOR/MOSI
RST_IN: sheet U_MONITOR/Reset_In, sheet U_Reset/Reset_Out
SCLK: sheet U_Header/SCLK(26), sheet U_SPI/SCLK(26), sheet U_MONITOR/SCLK
SCS: sheet U_Header/SCS(36), sheet U_SPI/SCS(36), sheet U_MONITOR/SCS
UART_RX: sheet U_Header/UART_RX(24), sheet U_MONITOR/UART_RX
UART_TX: sheet U_Header/UART_TX(21), sheet U_MONITOR/UART_TX
VCC: sheet U_MONITOR/VLED, sheet U_LCD/VLED
VDD_+3.3V: sheet U_MONITOR/Vout 3.3V, sheet U_LCD/VDD_+3.3V
Vin_in: sheet U_MONITOR/Vin, sheet U_Power/Vin
Vout 1.8V: sheet U_MONITOR/Vin_1V, sheet U_Power/Vout 1.8V
Vout_1V: sheet U_MONITOR/Vin_1.8V, sheet U_Power/Vout 1V
Vout_3V: sheet U_MONITOR/Vin_3V, sheet U_Power/Vout 3V
NetJ1_U_Header_1: sheet U_Header/GPIO_PAD_3(5), sheet U_LCD/GPIO_PAD_3(5)
NetJ1_U_Header_4: sheet U_Header/GPIO_PAD_2(8), sheet U_LCD/GPIO_PAD_2(8)
NetJ1_U_Header_6: sheet U_Header/GPIO_PAD_1(10), sheet U_LCD/GPIO_PAD_1(10)
NetJ1_U_Header_7: sheet U_Header/GPIO_PAD_0(13), sheet U_LCD/GPIO_PAD_0(13)
NetJ3_U_Header_3: sheet U_Header/Reset_Out(38), sheet U_MONITOR/Reset_Out
NetJ3_U_Header_6: sheet U_Header/CLK(42), sheet U_MONITOR/CLK out
NetJ4_U_Header_1: sheet U_Header/GPIO_PAD_7(53), sheet U_LCD/GPIO_PAD_7(53)
NetJ4_U_Header_4: sheet U_Header/GPIO_PAD_6(56), sheet U_LCD/GPIO_PAD_6(56)
NetJ4_U_Header_6: sheet U_Header/GPIO_PAD_5(58), sheet U_LCD/GPIO_PAD_5(58)
NetJ4_U_Header_7: sheet U_Header/GPIO_PAD_4(61), sheet U_LCD/GPIO_PAD_4(61)
NetP6_U_MONITOR_7: sheet U_CLOCK/CLK, sheet U_MONITOR/CLK in

## Nets that join several sheets
GND: U_Header (12 pins), U_CLOCK (C1.2 C2.2 U2.2 Y1.2), U_SPI (C3.1 J5.4), U_MONITOR (P4.2), U_Power (12 pins), U_Reset (SW1.3 SW1.4 U1.1), U_LCD (15 pins), U_Header (12 pins), U_CLOCK (C1_U_CLOCK.2 C2_U_CLOCK.2 U2_U_CLOCK.2 Y1_U_CLOCK.2), U_SPI (C3_U_SPI.1 J5_U_SPI.4), U_MONITOR (P4_U_MONITOR.2), U_Power (12 pins), U_Reset (SW1_U_Reset.3 SW1_U_Reset.4 U1_U_Reset.1), U_LCD (15 pins)
1.8V: U_Header (8 pins), U_CLOCK (5 pins), U_SPI (5 pins), U_MONITOR (P4.6), U_LCD (U3.3 U3.6 U4.3 U4.6)
1.8V: U_Header (20 pins), U_CLOCK (5 pins), U_SPI (5 pins), U_MONITOR (P4_U_MONITOR.6), U_LCD (U3_U_LCD.3 U3_U_LCD.6 U4_U_LCD.3 U4_U_LCD.6)
1V: U_Header (12 pins), U_MONITOR (P4.4)
3.3V: U_MONITOR (P5.2), U_LCD (P1.2 P1.3 U3.7 U4.7)
3V: U_MONITOR (P4.8 P5.1 P5.3), U_Reset (U1.4)
3V: U_MONITOR (P4_U_MONITOR.8 P5_U_MONITOR.1 P5_U_MONITOR.3), U_Reset (U1_U_Reset.4)
CLK: U_Header (J3.6), U_MONITOR (P6.8)
CLK_in: U_CLOCK (U2.1), U_MONITOR (P6.7)
GPIO_0: U_Header (J1.7), U_LCD (P2.1)
GPIO_1: U_Header (J1.6), U_LCD (P2.3)
GPIO_2: U_Header (J1.4), U_LCD (P2.5)
GPIO_3: U_Header (J1.1), U_LCD (P2.7)
GPIO_4: U_Header (J4.7), U_LCD (P3.1)
GPIO_5: U_Header (J4.6), U_LCD (P3.3)
GPIO_6: U_Header (J4.4), U_LCD (P3.5)
GPIO_7: U_Header (J4.1), U_LCD (P3.7)
MISO: U_Header (J2_U_Header.8), U_SPI (J5_U_SPI.5)
MISO_in: TOP_SCHEMATIC (1) (P7.3), U_Header (J2.8)
MISO_out: TOP_SCHEMATIC (1) (P7.4), U_SPI (J5.5)
MOSI: U_Header (J2_U_Header.7), U_SPI (J5_U_SPI.2)
MOSI_in: TOP_SCHEMATIC (1) (P7.6), U_SPI (J5.2)
MOSI_out: TOP_SCHEMATIC (1) (P7.5), U_Header (J2.7)
NetJ1_U_Header_1: U_Header (J1_U_Header.1), U_LCD (P2_U_LCD.7)
NetJ1_U_Header_4: U_Header (J1_U_Header.4), U_LCD (P2_U_LCD.5)
NetJ1_U_Header_6: U_Header (J1_U_Header.6), U_LCD (P2_U_LCD.3)
NetJ1_U_Header_7: U_Header (J1_U_Header.7), U_LCD (P2_U_LCD.1)
NetJ3_U_Header_3: U_Header (J3_U_Header.3), U_MONITOR (P6_U_MONITOR.6)
NetJ3_U_Header_6: U_Header (J3_U_Header.6), U_MONITOR (P6_U_MONITOR.8)
NetJ4_U_Header_1: U_Header (J4_U_Header.1), U_LCD (P3_U_LCD.7)
NetJ4_U_Header_4: U_Header (J4_U_Header.4), U_LCD (P3_U_LCD.5)
NetJ4_U_Header_6: U_Header (J4_U_Header.6), U_LCD (P3_U_LCD.3)
NetJ4_U_Header_7: U_Header (J4_U_Header.7), U_LCD (P3_U_LCD.1)
NetP6_U_MONITOR_7: U_CLOCK (U2_U_CLOCK.1), U_MONITOR (P6_U_MONITOR.7)
RST: U_Header (J3.3), U_MONITOR (P6.6)
RST_IN: U_MONITOR (P6.5), U_Reset (U1.2)
RST_IN: U_MONITOR (P6_U_MONITOR.5), U_Reset (U1_U_Reset.2)
SCLK: U_Header (J2_U_Header.6), U_SPI (J5_U_SPI.1 R4_U_SPI.2)
SCLK_in: TOP_SCHEMATIC (1) (P7.8), U_SPI (J5.1 R4.2)
SCLK_out: TOP_SCHEMATIC (1) (P7.7), U_Header (J2.6)
SCS: U_Header (J3_U_Header.1), U_SPI (J5_U_SPI.6)
SCS_in: TOP_SCHEMATIC (1) (P7.2), U_SPI (J5.6)
SCS_out: TOP_SCHEMATIC (1) (P7.1), U_Header (J3.1)
UART_RX: U_Header (J2.4), U_MONITOR (P6.2)
UART_RX: U_Header (J2_U_Header.4), U_MONITOR (P6_U_MONITOR.2)
UART_TX: U_Header (J2.2), U_MONITOR (P6.4)
UART_TX: U_Header (J2_U_Header.2), U_MONITOR (P6_U_MONITOR.4)
V_LED: U_MONITOR (P5.4), U_LCD (U5.5 U6.5 U7.5 U8.5)
VCC: U_MONITOR (P5_U_MONITOR.4), U_LCD (U5_U_LCD.5 U6_U_LCD.5 U7_U_LCD.5 U8_U_LCD.5)
VDD_+3.3V: U_MONITOR (P5_U_MONITOR.2), U_LCD (P1_U_LCD.2 P1_U_LCD.3 U3_U_LCD.7 U4_U_LCD.7)
Vin_in: U_MONITOR (P4.1), U_Power (9 pins)
Vin_in: U_MONITOR (P4_U_MONITOR.1), U_Power (9 pins)
Vout 1.8V: U_MONITOR (P4.3), U_Power (C9.2 MAX18.5)
Vout 1.8V: U_MONITOR (P4_U_MONITOR.3), U_Power (C9_U_Power.2 MAX18_U_Power.5)
Vout_1V: U_MONITOR (P4.5), U_Power (C12.2 TP.5)
Vout_1V: U_MONITOR (P4_U_MONITOR.5), U_Power (C12_U_Power.2 TP_U_Power.5)
Vout_3V: U_MONITOR (P4.7), U_Power (C6.2 MAX3.5)
Vout_3V: U_MONITOR (P4_U_MONITOR.7), U_Power (C6_U_Power.2 MAX3_U_Power.5)